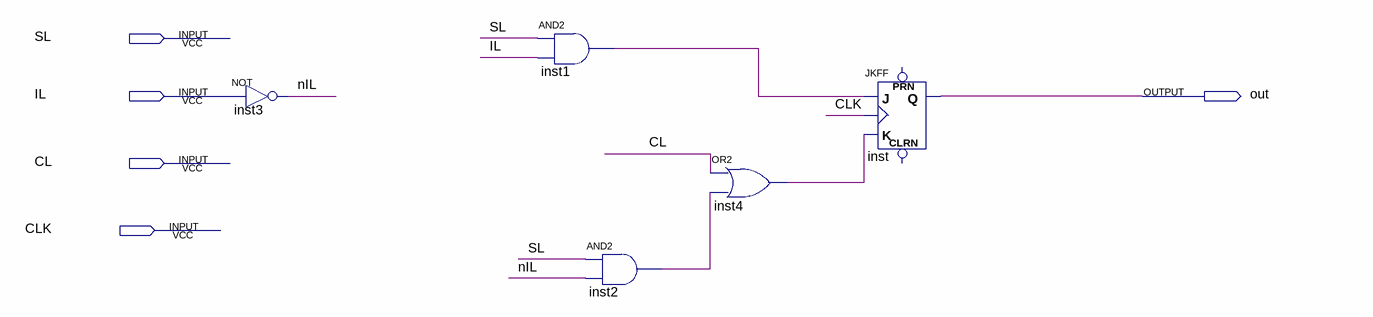
[diagram p0: schematic sheet]
// Quartus schematic MojREGStreak.bdf as structural Verilog: 5 symbols, 5 pins
module MojREGStreak (
  input  SL,
  input  IL,
  input  CL,
  input  CLK,
  output out
);

  wire inst1_out, inst2_out, inst4_out, nIL;

  not inst3 (nIL, IL);
  and inst1 (inst1_out, SL, IL);
  and inst2 (inst2_out, SL, nIL);
  or inst4 (inst4_out, CL, inst2_out);
  JKFF inst (.K(inst4_out), .J(inst1_out), .CLK(CLK), .Q(out));  // open: PRN, CLRN
endmodule
